# EAGLE design attiny85_soap (EAGLE 7.7.0)
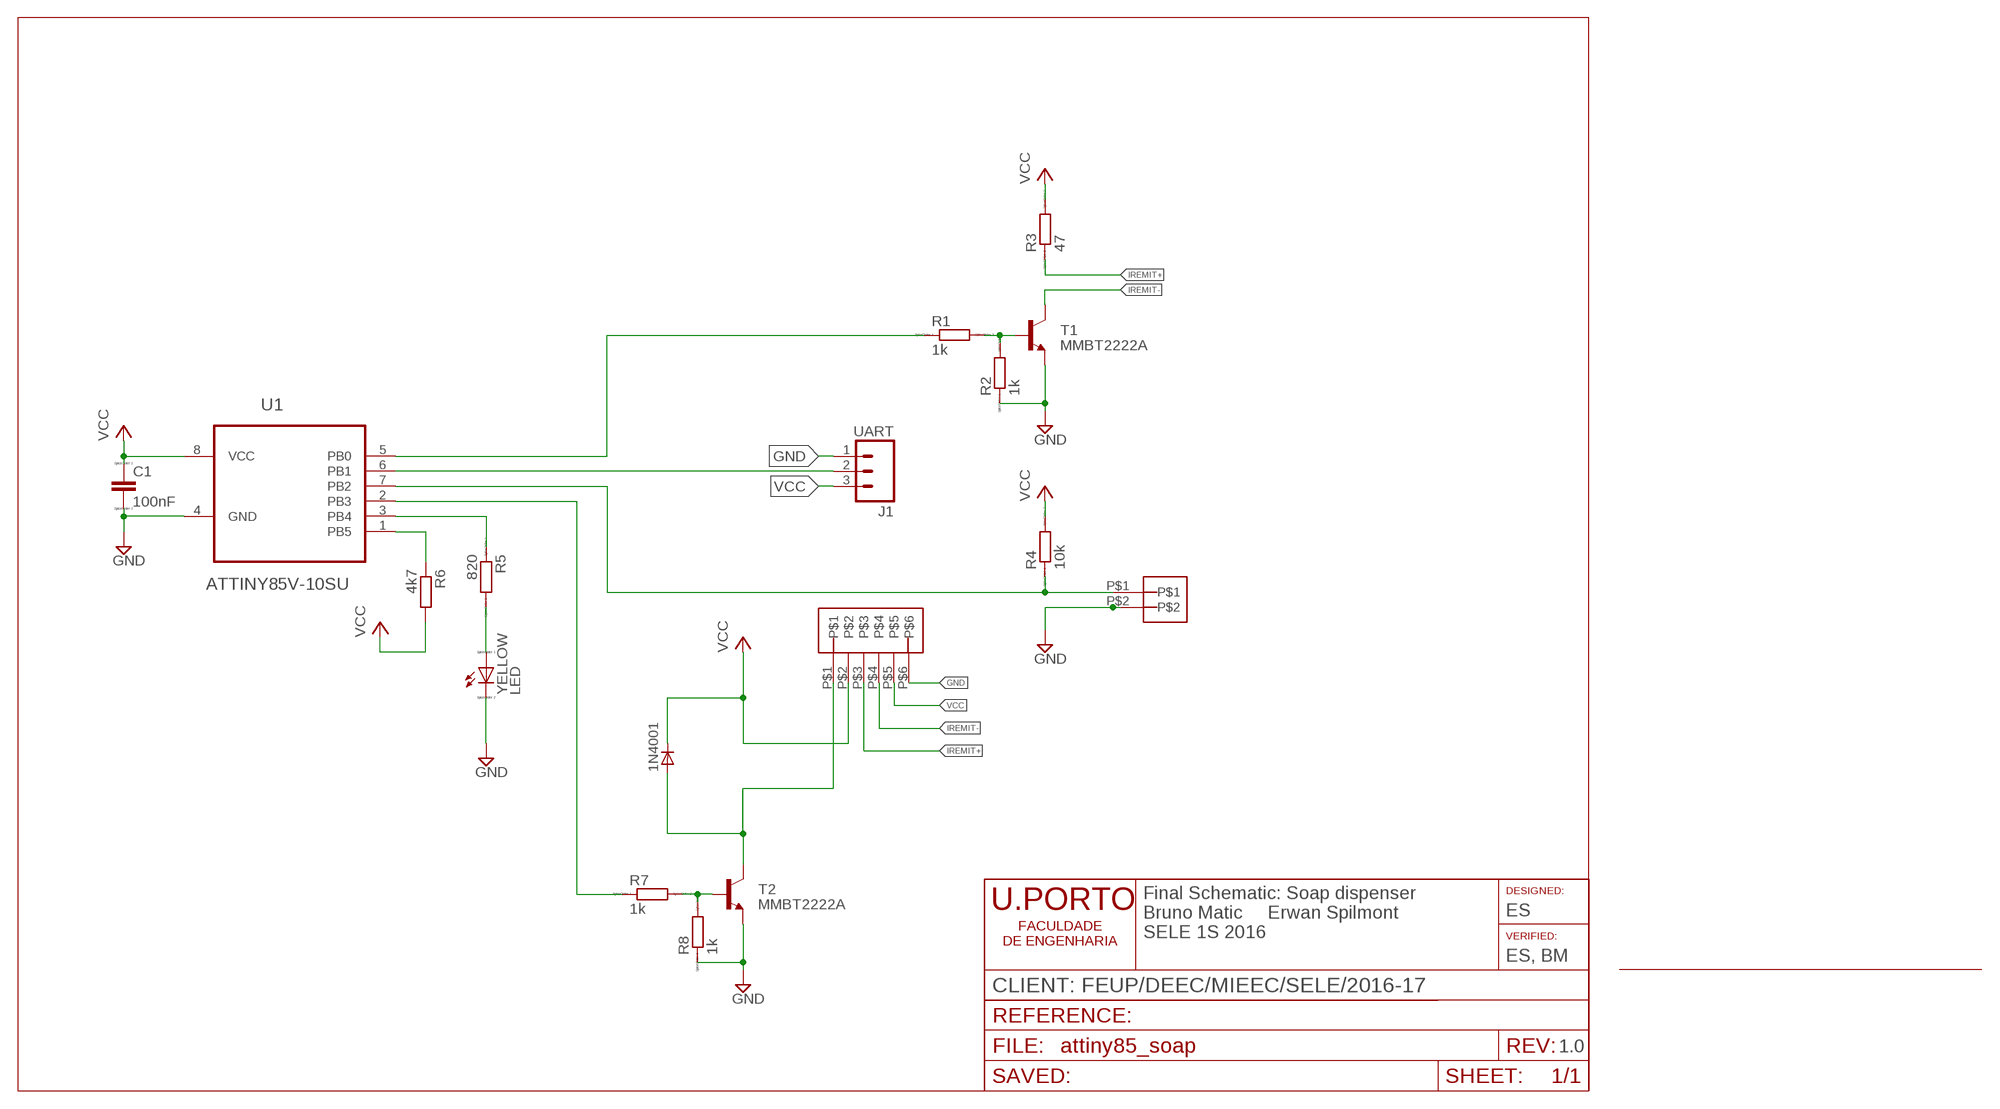
[diagram p0: schematic, sheet 1]

## Parts
1N4001  SM400GENERIC  [MELF-MLL41_DO213AB]
C1  100nF  CC0603  [C0603]
IRDET_CON  2_PIN_JST-XH  [2_PIN_JST-XH]
J1  UART  M031X03_NO_SILK  [1X03_NO_SILK]
R1  1k  R  [R0805]
R2  1k  R  [R0805]
R3  47  R  [R0805]
R4  10k  R  [R0805]
R5  820  R  [R0805]
R6  4k7  R-EU_R0805  [R0805]
R7  1k  R  [R0805]
R8  1k  R  [R0805]
T1  MMBT2222A  MMBT2222ALT1-NPN-SOT23-BEC  [SOT23-BEC]
T2  MMBT2222A  MMBT2222ALT1-NPN-SOT23-BEC  [SOT23-BEC]
U1  ATTINY85V-10SU  [SOIC127P798X216-8N]
U$1  6_PIN_JST-XH  [6_PIN_JST-XH]
YELLOW  LED  LED_ELD260  [LED_LD260]

## Nets
GND: C1.2 IRDET_CON.P$2 J1.1 R2.1 R8.1 T1.E T2.E U1.4(GND) U$1.P$6 YELLOW.K(C)
IREMIT+: R3.1 U$1.P$3
IREMIT-: T1.C U$1.P$4
IRRC+: IRDET_CON.P$1 R4.1 U1.7(PB2)
N$1: R6.1 U1.1(PB5)
N$2: R1.2 R2.2 T1.B
N$3: R7.1 U1.2(PB3)
N$4: J1.2 U1.6(PB1)
N$5: R7.2 R8.2 T2.B
N$6: R5.1 U1.3(PB4)
N$8: R1.1 U1.5(PB0)
N$9: R5.2 YELLOW.A
PUMP-: 1N4001.A T2.C U$1.P$1
VCC: 1N4001.C C1.1 J1.3 R3.2 R4.2 R6.2 U1.8(VCC) U$1.P$2 U$1.P$5

## Notes on the sheet
- Final Schematic: Soap dispenser
  Bruno Matic     Erwan Spilmont
  SELE 1S 2016
- ES
- ES, BM
- CLIENT: FEUP/DEEC/MIEEC/SELE/2016-17
- 1.0

## Library data of the parts
1N4001 = _hhn_diodes_smd:SM400*: SM4001 .. SM4007 General Purpose Rectifier, 1 A SMD-Version of 1N4001 .. 1N4007 Case: MELF-MLL41 = DO 213 AB Author: Dipl.-Ing. FH Rainer Bayer HHN Hochschule Heilbronn, rainer.bayer@hs-heilbronn.de Ingenieurbüro ing-rb, mail@ing-rb.de
C1 = eagle-ltspice:C: CAPACITOR, European symbol; SPICEMODEL: NONE; SPICEPREFIX: C
IRDET_CON = JST-XH_HEADERS:2_PIN_JST-XH
J1 = SparkFun-Connectors:M03: Header 3 Standard 3-pin 0.1" header. Use with straight break away headers (SKU : PRT-00116), right angle break away headers (PRT-00553), swiss pins (PRT-00743), machine pins (PRT-00117), and female headers (PRT-00115). Molex polarized connector foot print use with SKU : PRT-08232 with associated crimp pins and housings.
R1-R5 R7 R8 = eagle-ltspice:R: RESISTOR, European symbol; SPICEMODEL: NONE; SPICEPREFIX: R
R6 = rcl:R-EU_: RESISTOR, European symbol
T1 T2 = transistor:*-NPN-: NPN Transistror BF959 corrected 2008.03.06
U1 = Atmel_By_element14_Batch_1-00:ATTINY85V-10SU: 8-bit Microcontroller with In-System Programmable Flash; MPN: ATTINY85V-10SU; OC_FARNELL: 1455166; OC_NEWARK: 58M3799; PACKAGE: SOIC-8; SUPPLIER: Atmel
U$1 = JST-XH_HEADERS:6_PIN_JST-XH
YELLOW = eagle-ltspice:LED_E: LED Source: http://www.osram.convergy.de Source: www.luxeon.com Source: www.kingbright.com; SPICEMODEL: NONE; SPICEPREFIX: D; SPICETYPE: diode

## Board
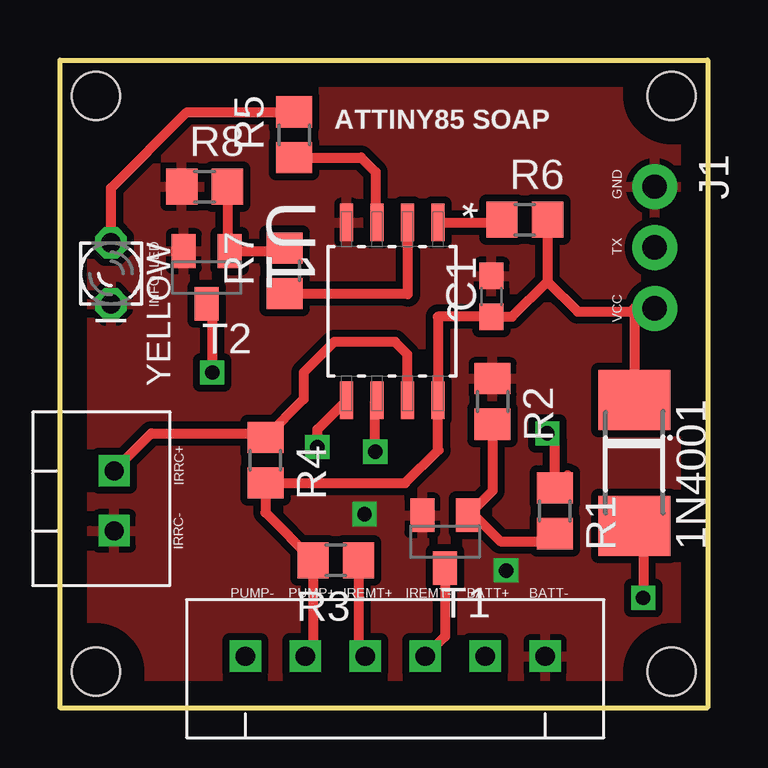
[diagram p1: board, top side]
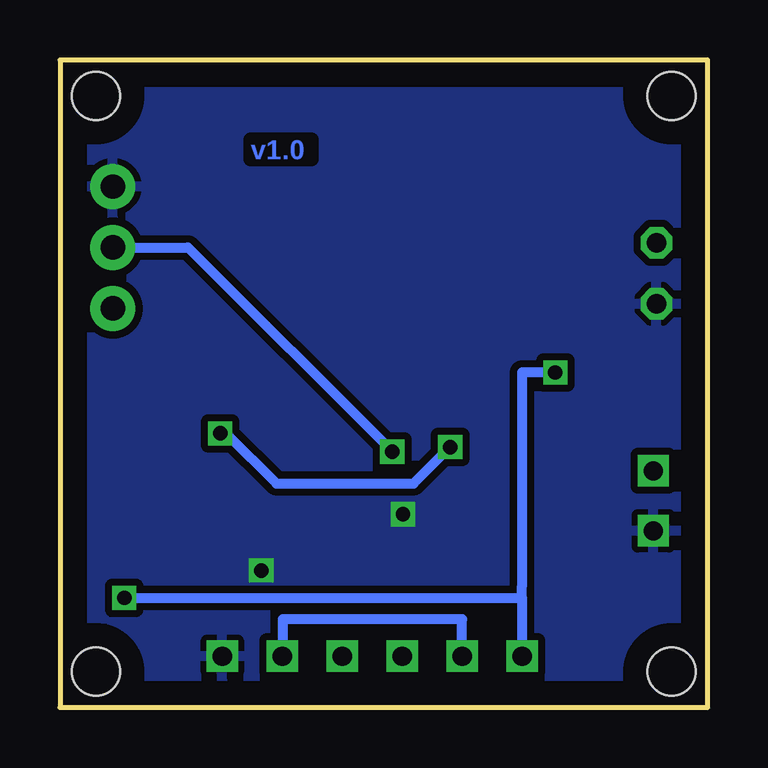
[diagram p2: board, bottom side, seen from below]

Size 27 x 27 mm. Coordinates in mm from the lower left corner, seen from the top.
Outline: 0,0 27,0 27,27 0,27 0,0
Copper layers (1*16): Top 0.035mm / dielectric 1.5mm / Bottom 0.035mm
Design rules "default *": minimum track width 10mil, minimum drill 20mil, track to track 8mil, track to pad 8mil, pad to pad 8mil, via to via 8mil, smd to smd 8mil, copper to edge 40mil, drill to drill 8mil, minimum pad ring 10mil, minimum via ring 8mil, stop-mask expansion 4mil, vias tented up to drill 0mil, thermal gap 10mil
Holes 2 mm at 1.5,25.5 25.5,25.5 1.5,1.5 25.5,1.5

### Footprints (pad centres in the part's own frame; a part is rotated, then mirrored left to right if it is on the bottom)
MELF-MLL41_DO213AB = smd 2.5 x 3: A 2.625,0; C -2.625,0
C0603 = smd 1.1 x 1: 1 -0.85,0; 2 0.85,0
2_PIN_JST-XH = drill 0.8 square: P$1 2.45,3.4; P$2 4.95,3.4
1X03_NO_SILK = drill 1.016 pad 1.88: 1 0,0; 2 2.54,0; 3 5.08,0
R0805 = smd 1.3 x 1.5: 1 -0.95,0; 2 0.95,0
SOT23-BEC = smd 1 x 1.4: B -0.95,-1.1; C 0,1.1; E 0.95,-1.1
SOIC127P798X216-8N = smd 1.549 x 0.533: 1 -3.708,1.905; 2 -3.708,0.635; 3 -3.708,-0.635; 4 -3.708,-1.905; 5 3.708,-1.905; 6 3.708,-0.635; 7 3.708,0.635; 8 3.708,1.905
6_PIN_JST-XH = drill 0.8 square: P$1 2.45,3.4; P$2 4.95,3.4; P$3 7.45,3.4; P$4 9.95,3.4; P$5 12.45,3.4; P$6 14.95,3.4
LED_LD260 = drill 0.813 octagon: A -1.27,0; K 1.27,0

### Placement (x,y rotation side)
1N4001  23.94,10.19 270 top
C1  18,17.14 90 top
IRDET_CON  -1.14,12.32 270 top
J1  24.79,21.72 270 top
R1  20.63,8.2 270 top
R2  18.03,12.76 270 top
R3  11.5,6.14 180 top
R4  8.56,10.31 270 top
R5  9.77,23.88 90 top
R6  19.38,20.34 0 top
R7  9.35,18.21 90 top
R8  6.03,21.72 0 top
T1  16.06,6.91 180 top
T2  6.11,17.93 180 top
U1  13.85,16.52 270 top
U$1  5.28,-1.26 0 top
YELLOW  2.13,18.1 270 top

### Tracks (layer width: path | path; a pad name or v marks a point on that pad's centre or on a via)
GND  (via drill 0.6)
  other vias: 18.61,5.71 12.7,8.06
  pour Top (isolate 0.305): 0,26.99 0,0 26.99,0 26.99,26.99
  pour Bottom (isolate 0.305): 0,26.99 0,0 26.99,0 26.99,26.99
IREMIT+
  Top 0.406: R3.1 12.45,2.42 U$1.P$3
IREMIT-
  Top 0.406: T1.C 16.06,2.97 U$1.P$4
IRRC+
  Top 0.406: U1.7 14.48,14.72 13.97,15.24 11.43,15.24 10.16,13.97 10.16,12.86 R4.1 8.4,11.43 3.81,11.43 IRDET_CON.P$1
N$1
  Top 0.406: U1.1 18.32,20.23 R6.1
N$2
  Top 0.406: R1.2 20.31,6.93 18.36,6.93 17.28,8.01 T1.B 18.03,9.04 R2.2
N$3
  Top 0.406: 14.44,20.28 U1.2 14.5,20.21 14.5,17.22 14.46,17.26 R7.1
N$4  (via drill 0.6)
  Top 0.406: v13.14,10.67 13.14,12.74 U1.6
  Bottom 0.406: J1.2 21.66,19.18 v13.14,10.67
N$5
  Top 0.406: R7.2 9.22,19.03 T2.B 6.98,19.11 R8.2
N$6
  Top 0.406: 13.26,20.27 U1.3 13.16,20.29 13.16,22.33 12.55,22.93 R5.1
N$8  (via drill 0.6)
  Top 0.406: 21.16,9.68 R1.1 20.63,11.12 v20.32,11.43 | v10.73,10.86 10.73,11.6 U1.5
  Bottom 0.406: v20.32,11.43 20.07,11.43 17.97,9.34 12.26,9.34 v10.73,10.86
N$9
  Top 0.406: YELLOW.A 2.13,21.66 5.28,24.82 7.22,24.82 R5.2
PUMP-  (via drill 0.6)
  Top 0.406: T2.C 6.35,16.83 v6.35,13.97 | 1N4001.A 24.32,7.56 v24.32,4.57
  Bottom 0.406: v6.35,13.97 7.73,13.97 7.73,5.08 7.73,4.57 | 7.73,4.57 U$1.P$1 | v24.32,4.57 7.73,4.57
VCC
  Top 0.406: 15.77,10.74 14.39,9.36 R4.2 8.56,8.13 R3.2 10.55,2.46 U$1.P$2 | 15.77,10.74 15.76,10.74 U1.8 15.76,16.29 C1.1 18.85,16.29 20.33,17.77 | J1.3 24.13,16.64 | 24.13,16.64 23.94,16.64 1N4001.C | 15.79,10.73 15.77,10.74 | R6.2 20.33,17.77 | 20.33,17.77 21.59,16.51 24,16.51 24.13,16.64
  Bottom 0.406: U$1.P$2 10.23,3.68 10.22,3.68 17.72,3.68 17.72,2.15 U$1.P$5

### Text on the board
Bottom: v1.0
tPlace: ATTINY85 SOAP | GND | TX | INFO_LED | VCC | IRRC+ | IRRC- | PUMP- | PUMP+ | IREMT+ | IREMT- | BATT+ | BATT-